# Altium schematic sheet power_supply.SchDoc
size A4; SheetNumber: 6; SheetTotal: 6
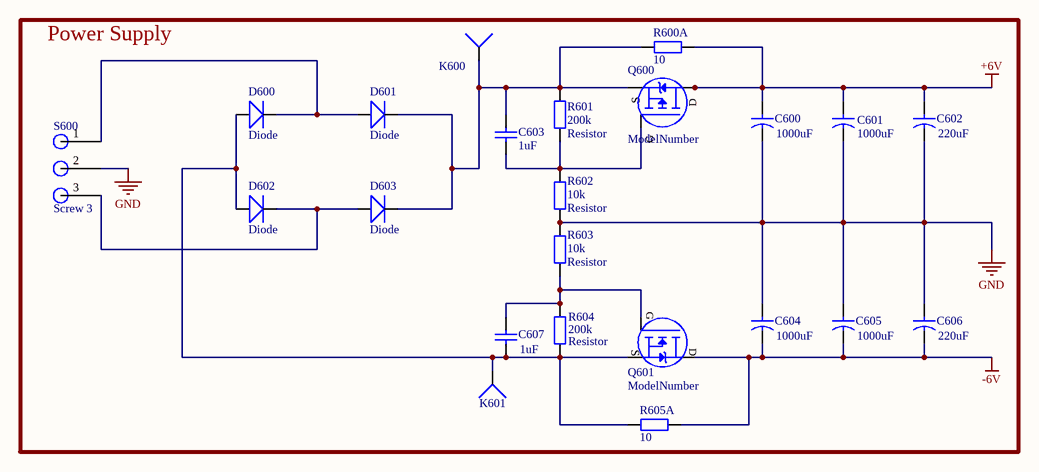
[diagram p0: power_supply.SchDoc]

## Parts
C600  value 1000uF  [Cap Lyt Ø18]  (hidden comment: Cap)
C601  value 1000uF  [Cap Lyt Ø18]  (hidden comment: Cap)
C602  value 220uF  [Cap Lyt Ø8]  (hidden comment: Cap)
C603  value 1uF  [Cap-1]  (hidden comment: Cap)
C604  value 1000uF  [Cap Lyt Ø18]  (hidden comment: Cap)
C605  value 1000uF  [Cap Lyt Ø18]  (hidden comment: Cap)
C606  value 220uF  [Cap Lyt Ø8]  (hidden comment: Cap)
C607  value 1uF  [Cap-1]  (hidden comment: Cap)
D600  Diode  [Diode 1A]
D601  Diode  [Diode 1A]
D602  Diode  [Diode 1A]
D603  Diode  [Diode 1A]
K600  Wire  [Wire 1.5mm]  (value not drawn)
K601  Wire  [Wire 1.5mm]  (value not drawn)
Q600  Model: ModelNumber  [TO-220]  (hidden comment: ModelNum)
Q601  Model: ModelNumber  [TO-220]  (hidden comment: ModelNum)
R600  10  [POW RES THT 13mm]  (part A of 2)
R601  Resistor  value 200k  [RES THT 9mm]
R602  Resistor  value 10k  [RES THT 9mm]
R603  Resistor  value 10k  [RES THT 9mm]
R604  Resistor  value 200k  [RES THT 9mm]
R605  10  [POW RES THT 13mm]  (part A of 2)
S600  Screw 3  [Screw-3]

## Blocks framed on the sheet
Power Supply: C600-C607 D600-D603 K600 K601 Q600 Q601 R600-R605 S600

## Nets
+6V: C600.1 C601.1 C602.1 Q600.3(D) Q600.4(D) R600.2
-6V: C604.2(g) C605.2(g) C606.2(g) Q601.2(D) R605.2
GND: C600.2(g) C601.2(g) C602.2(g) C604.1 C605.1 C606.1 R602.1 R603.2 S600.2
NetC603_1: C603.1 Q600.2(G) R601.1 R602.2
NetC603_2: C603.2(g) D601.2 D603.2 K600.1 Q600.1(S) R600.1 R601.2
NetC607_1: C607.1 D600.1 D602.1 K601.1 Q601.3(S) R604.1 R605.1
NetC607_2: C607.2(g) Q601.1(G) R603.1 R604.2
NetD600_2: D600.2 D601.1 S600.1
NetD602_2: D602.2 D603.1 S600.3

## Library data of the parts
C600-C602 C604-C606 = Capacitor electrolytic
C603 C607 = Capacitor 1 space
Q600 = MOSFET P-Channel
Q601 = MOSFET N-Channel
R600 R605 = POW RES THT 13mm